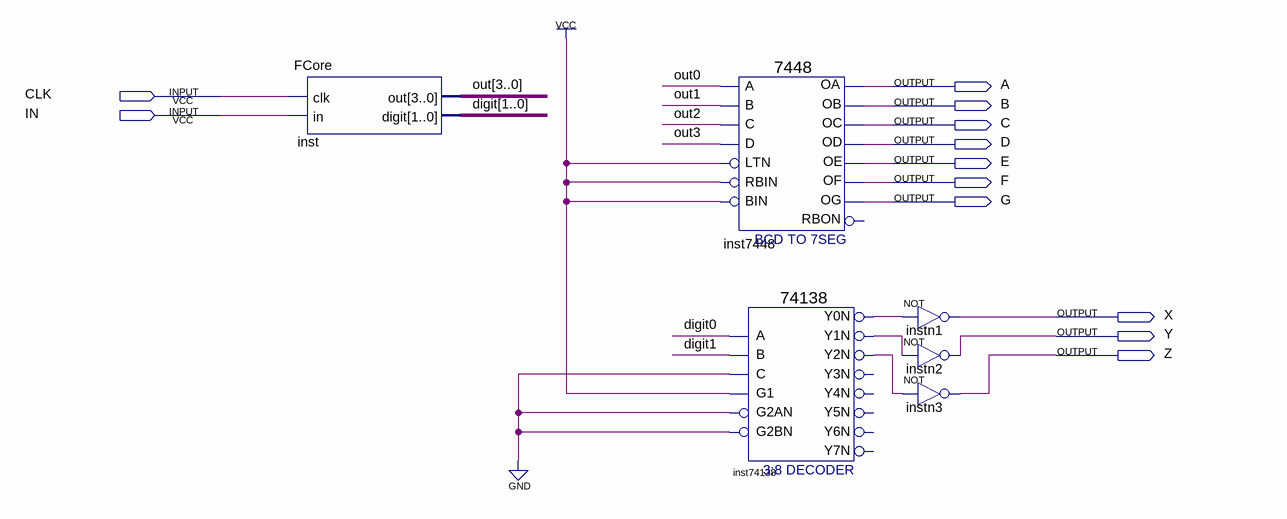
[diagram p0: schematic sheet]
// Quartus schematic Block.bdf as structural Verilog: 6 symbols, 12 pins
module Block (
  input  CLK,
  input  IN,
  output A,
  output B,
  output C,
  output D,
  output E,
  output F,
  output G,
  output X,
  output Y,
  output Z
);

  wire inst74138_y0n, inst74138_y1n, inst74138_y2n;
  wire [1:0] digit;
  wire [3:0] out;

  FCore inst (.clk(CLK), .in(IN), .out(out), .digit(digit));
  \7448  inst7448 (
    .A(out[0]), .C(out[2]), .D(out[3]), .B(out[1]), .RBIN(1'b1), .BIN(1'b1), .LTN(1'b1), .OC(C), .OE(E),
    .OD(D), .OF(F), .OG(G), .OB(B), .OA(A));  // open: RBON
  \74138  inst74138 (
    .A(digit[0]), .B(digit[1]), .G1(1'b1), .C(1'b0), .G2AN(1'b0), .G2BN(1'b0), .Y0N(inst74138_y0n),
    .Y1N(inst74138_y1n), .Y2N(inst74138_y2n));  // open: Y3N, Y4N, Y5N, Y6N, Y7N
  not instn1 (X, inst74138_y0n);
  not instn2 (Y, inst74138_y1n);
  not instn3 (Z, inst74138_y2n);
endmodule
